# Altium schematic sheet ESP32_schematic.SchDoc
size A4; SheetNumber: 1; SheetTotal: 1
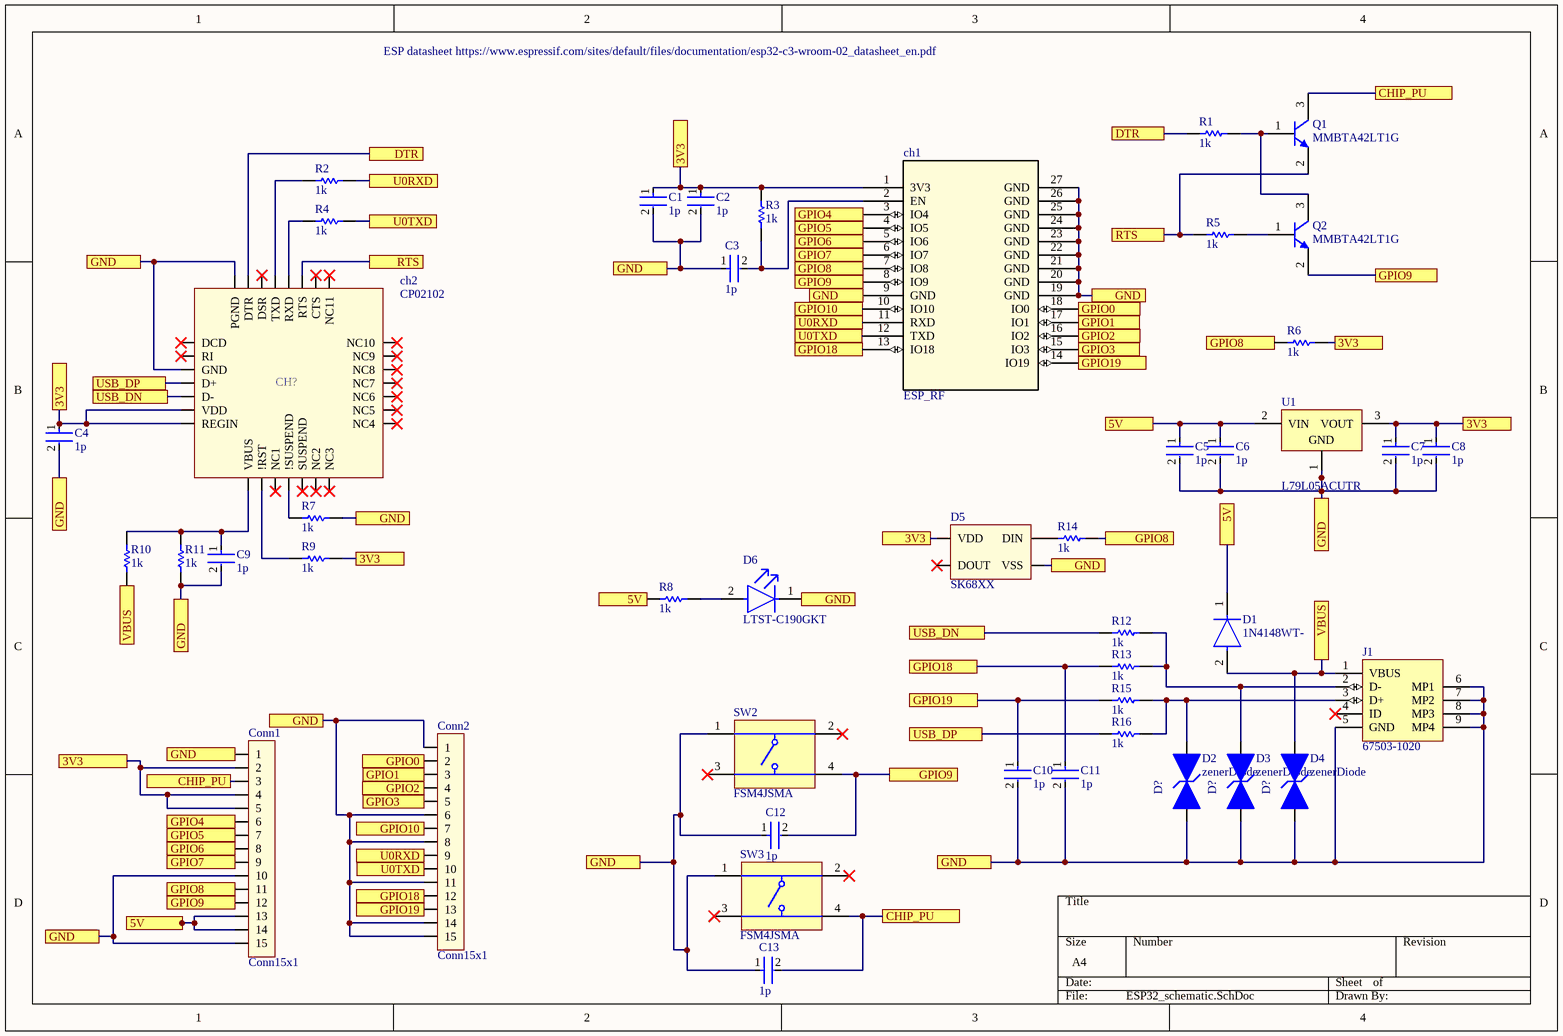
[diagram p0: ESP32_schematic.SchDoc]

## Parts
C1  1p  [FP-C0402-BB-MFG]
C2  1p  [FP-C0402-BB-MFG]
C3  1p  [FP-C0402-BB-MFG]
C4  1p  [FP-C0402-BB-MFG]
C5  1p  [FP-C0402-BB-MFG]
C6  1p  [FP-C0402-BB-MFG]
C7  1p  [FP-C0402-BB-MFG]
C8  1p  [FP-C0402-BB-MFG]
C9  1p  [FP-C0402-BB-MFG]
C10  1p  [FP-C0402-BB-MFG]
C11  1p  [FP-C0402-BB-MFG]
C12  1p  [FP-C0402-BB-MFG]
C13  1p  [FP-C0402-BB-MFG]
ch1  ESP_RF  [ESP_RF - duplicate]
ch2  CP02102  [ESPchip]
Conn1  Conn15x1  [Conn15x1]
Conn2  Conn15x1  [Conn15x1]
D1  1N4148WT-  [FP-SOD523-MFG]
D2  zenerDiode  [LESD5D5]
D3  zenerDiode  [LESD5D5]
D4  zenerDiode  [LESD5D5]
D5  SK68XX  [SD68XX]
D6  LTST-C190GKT  [FP-LTST-C190GKT-MFG]
J1  67503-1020  [MOLX-67503-1020_V]
Q1  MMBTA42LT1G  [ONSC-SOT-23-3-318-08_V]
Q2  MMBTA42LT1G  [ONSC-SOT-23-3-318-08_V]
R1  1k  [RESC1609X50X30NL8T20]
R2  1k  [RESC1609X50X30NL8T20]
R3  1k  [RESC1609X50X30NL8T20]
R4  1k  [RESC1609X50X30NL8T20]
R5  1k  [RESC1609X50X30NL8T20]
R6  1k  [RESC1609X50X30NL8T20]
R7  1k  [RESC1609X50X30NL8T20]
R8  1k  [RESC1609X50X30NL8T20]
R9  1k  [RESC1609X50X30NL8T20]
R10  1k  [RESC1609X50X30NL8T20]
R11  1k  [RESC1609X50X30NL8T20]
R12  1k  [RESC1609X50X30NL8T20]
R13  1k  [RESC1609X50X30NL8T20]
R14  1k  [RESC1609X50X30NL8T20]
R15  1k  [RESC1609X50X30NL8T20]
R16  1k  [RESC1609X50X30NL8T20]
SW2  FSM4JSMA  [TECO-FSM4JSMA_V]
SW3  FSM4JSMA  [TECO-FSM4JSMA_V]
U1  L79L05ACUTR  [SOT-89_L]

## Ports
3V3 (see ESP32_schematic[1B], ESP32_schematic[1C], ESP32_schematic[2A], ESP32_schematic[3C], ESP32_schematic[4B]), 3V3 (see ESP32_schematic[1B], ESP32_schematic[1C], ESP32_schematic[2A], ESP32_schematic[4B]), 3V3 (see ESP32_schematic[1B], ESP32_schematic[1C], ESP32_schematic[3C], ESP32_schematic[4B]), 3V3 (see ESP32_schematic[1C], ESP32_schematic[2A], ESP32_schematic[3C], ESP32_schematic[4B]), 5V (see ESP32_schematic[1D], ESP32_schematic[2C], ESP32_schematic[3B]), 5V (see ESP32_schematic[1D], ESP32_schematic[2C], ESP32_schematic[4C]), 5V (see ESP32_schematic[1D], ESP32_schematic[3B], ESP32_schematic[4C]), 5V (see ESP32_schematic[2C], ESP32_schematic[3B], ESP32_schematic[4C]), CHIP_PU (see ESP32_schematic[1D], ESP32_schematic[3D]), CHIP_PU (see ESP32_schematic[1D], ESP32_schematic[4A]), CHIP_PU (see ESP32_schematic[3D], ESP32_schematic[4A]), DTR (see ESP32_schematic[1A]), DTR (see ESP32_schematic[3A]), GND (see ESP32_schematic[1B], ESP32_schematic[1C], ESP32_schematic[1D], ESP32_schematic[2B], ESP32_schematic[2D], ESP32_schematic[3B], ESP32_schematic[3C], ESP32_schematic[3D]), GND (see ESP32_schematic[1B], ESP32_schematic[1C], ESP32_schematic[1D], ESP32_schematic[2B], ESP32_schematic[2D], ESP32_schematic[3B], ESP32_schematic[3C], ESP32_schematic[3D], ESP32_schematic[4C]), GND (see ESP32_schematic[1B], ESP32_schematic[1C], ESP32_schematic[1D], ESP32_schematic[2B], ESP32_schematic[2D], ESP32_schematic[3B], ESP32_schematic[3C], ESP32_schematic[4C]), GND (see ESP32_schematic[1B], ESP32_schematic[1C], ESP32_schematic[1D], ESP32_schematic[2B], ESP32_schematic[3B], ESP32_schematic[3C], ESP32_schematic[3D], ESP32_schematic[4C]), GND (see ESP32_schematic[1B], ESP32_schematic[1C], ESP32_schematic[1D], ESP32_schematic[2D], ESP32_schematic[3B], ESP32_schematic[3C], ESP32_schematic[3D], ESP32_schematic[4C]), GND (see ESP32_schematic[1B], ESP32_schematic[1C], ESP32_schematic[2B], ESP32_schematic[2D], ESP32_schematic[3B], ESP32_schematic[3C], ESP32_schematic[3D], ESP32_schematic[4C]), GND (see ESP32_schematic[1C], ESP32_schematic[1D], ESP32_schematic[2B], ESP32_schematic[2D], ESP32_schematic[3B], ESP32_schematic[3C], ESP32_schematic[3D], ESP32_schematic[4C]), GPIO0 (see ESP32_schematic[1C]), GPIO0 (see ESP32_schematic[3B]), GPIO1 (see ESP32_schematic[1D]), GPIO1 (see ESP32_schematic[3B]), GPIO2 (see ESP32_schematic[1D]), GPIO2 (see ESP32_schematic[3B]), GPIO3 (see ESP32_schematic[1D]), GPIO3 (see ESP32_schematic[3B]), GPIO4 (see ESP32_schematic[1D]), GPIO4 (see ESP32_schematic[3A]), GPIO5 (see ESP32_schematic[1D]), GPIO5 (see ESP32_schematic[3A]), GPIO6 (see ESP32_schematic[1D]), GPIO6 (see ESP32_schematic[3A]), GPIO7 (see ESP32_schematic[1D]), GPIO7 (see ESP32_schematic[3A]), GPIO8 (see ESP32_schematic[1D], ESP32_schematic[3B], ESP32_schematic[3C]), GPIO8 (see ESP32_schematic[1D], ESP32_schematic[3B], ESP32_schematic[4B]), GPIO8 (see ESP32_schematic[1D], ESP32_schematic[3C], ESP32_schematic[4B]), GPIO8 (see ESP32_schematic[3B], ESP32_schematic[3C], ESP32_schematic[4B]), GPIO9 (see ESP32_schematic[1D], ESP32_schematic[3B], ESP32_schematic[3D]), GPIO9 (see ESP32_schematic[1D], ESP32_schematic[3B], ESP32_schematic[4B]), GPIO9 (see ESP32_schematic[1D], ESP32_schematic[3D], ESP32_schematic[4B]), GPIO9 (see ESP32_schematic[3B], ESP32_schematic[3D], ESP32_schematic[4B]), GPIO10 (see ESP32_schematic[1D]), GPIO10 (see ESP32_schematic[3B]), GPIO18 (see ESP32_schematic[1D], ESP32_schematic[3B]), GPIO18 (see ESP32_schematic[1D], ESP32_schematic[3C]), GPIO18 (see ESP32_schematic[3B], ESP32_schematic[3C]), GPIO19 (see ESP32_schematic[1D], ESP32_schematic[3B]), GPIO19 (see ESP32_schematic[1D], ESP32_schematic[3C]), GPIO19 (see ESP32_schematic[3B], ESP32_schematic[3C]), RTS (see ESP32_schematic[1B]), RTS (see ESP32_schematic[3A]), U0RXD (see ESP32_schematic[1A], ESP32_schematic[1D]), U0RXD (see ESP32_schematic[1A], ESP32_schematic[3B]), U0RXD (see ESP32_schematic[1D], ESP32_schematic[3B]), U0TXD (see ESP32_schematic[1A], ESP32_schematic[1D]), U0TXD (see ESP32_schematic[1A], ESP32_schematic[3B]), U0TXD (see ESP32_schematic[1D], ESP32_schematic[3B]), USB_DN (see ESP32_schematic[1B]), USB_DN (see ESP32_schematic[3C]), USB_DP (see ESP32_schematic[1B]), USB_DP (see ESP32_schematic[3C]), VBUS (see ESP32_schematic[1C]), VBUS (see ESP32_schematic[4C])

## Nets
3V3: C1.1 C2.1 C4.1 C7.1 C8.1 ch1.1(3V3) ch2.6(VDD) ch2.7(REGIN) Conn1.2 Conn1.4 Conn1.5 D5.3(VDD) R3.2 R6.2 R9.2 U1.3(VOUT) ; port 3V3
5V: C5.1 C6.1 Conn1.13 Conn1.14 D1.1(C) R8.1 U1.2(VIN) ; port 5V
CHIP_PU: C13.2 Conn1.3 Q1.3(C) SW3.4 ; port CHIP_PU
DTR: ch2.28(DTR) R1.1 ; port DTR
GND: C1.2 C2.2 C3.1 C4.2 C5.2 C6.2 C7.2 C8.2 C9.2 C10.2 C11.2 C12.1 C13.1 ch1.9(GND) ch1.19(GND) ch1.20(GND) ch1.21(GND) ch1.22(GND) ch1.23(GND) ch1.24(GND) ch1.25(GND) ch1.26(GND) ch1.27(GND) ch2.3(GND) ch2.29(PGND) Conn1.1 Conn1.10 Conn1.15 Conn2.1 Conn2.6 Conn2.8 Conn2.11 Conn2.14 Conn2.15 D2.1 D3.1 D4.1 D5.1(VSS) D6.1(C) J1.5(GND) J1.6(MP1) J1.7(MP2) J1.8(MP3) J1.9(MP4) R7.2 R11.1 SW2.1 SW3.1 U1.1(GND) ; port GND
GPIO0: ch1.18(IO0) Conn2.2 ; port GPIO0
GPIO1: ch1.17(IO1) Conn2.3 ; port GPIO1
GPIO2: ch1.16(IO2) Conn2.4 ; port GPIO2
GPIO3: ch1.15(IO3) Conn2.5 ; port GPIO3
GPIO4: ch1.3(IO4) Conn1.6 ; port GPIO4
GPIO5: ch1.4(IO5) Conn1.7 ; port GPIO5
GPIO6: ch1.5(IO6) Conn1.8 ; port GPIO6
GPIO7: ch1.6(IO7) Conn1.9 ; port GPIO7
GPIO8: ch1.7(IO8) Conn1.11 R6.1 R14.2 ; port GPIO8
GPIO9: C12.2 ch1.8(IO9) Conn1.12 Q2.2(E) SW2.4 ; port GPIO9
GPIO10: ch1.10(IO10) Conn2.7 ; port GPIO10
GPIO18: C11.1 ch1.13(IO18) Conn2.12 R13.1 ; port GPIO18
GPIO19: C10.1 ch1.14(IO19) Conn2.13 R15.1 ; port GPIO19
RTS: ch2.24(RTS) Q1.2(E) R5.1 ; port RTS
U0RXD: ch1.11(RXD) Conn2.9 R2.2 ; port U0RXD
U0TXD: ch1.12(TXD) Conn2.10 R4.2 ; port U0TXD
USB_DN: ch2.5(D-) R12.1 ; port USB_DN
USB_DP: ch2.4(D+) R16.1 ; port USB_DP
VBUS: D1.2(A) D4.2 J1.1(VBUS) R10.1 ; port VBUS
NetC3_2: C3.2 ch1.2(EN) R3.1
NetC9_1: C9.1 ch2.8(VBUS) R10.2 R11.2
Netch2_9: ch2.9(!RST) R9.1
Netch2_11: ch2.11(!SUSPEND) R7.1
Netch2_25: ch2.25(RXD) R4.1
Netch2_26: ch2.26(TXD) R2.1
NetD2_2: D2.2 J1.3(D+) R15.2 R16.2
NetD3_2: D3.2 J1.2(D-) R12.2 R13.2
NetD5_2: D5.2(DIN) R14.1
NetD6_2: D6.2(A) R8.2
NetQ1_1: Q1.1(B) Q2.3(C) R1.2
NetQ2_1: Q2.1(B) R5.2

Not connected (* = marked no-connect by the designer): ch2 1(DCD)* 2(RI)* 10(NC1)* 12(SUSPEND)* 13(NC2)* 14(NC3)* 15(NC4)* 16(NC5)* 17(NC6)* 18(NC7)* 19(NC8)* 20(NC9)* 21(NC10)* 22(NC11)* 23(CTS)* 27(DSR)*; D5 4(DOUT)*; J1 4(ID)*; SW2 2* 3*; SW3 2* 3*

## Notes on the sheet
- ESP datasheet https://www.espressif.com/sites/default/files/documentation/esp32-c3-wroom-02_datasheet_en.pdf
- (in symbol CP02102) CH?
- (in symbol zenerDiode) D?

## Library data of the parts
C1-C13 = CMP-2008-02046-2: CAP CER 0.1UF 10V X5R 0402; Manufacturer: Kemet; Manufacturer Part Number: C0402C104K8PACTU; Material: Ceramic; Capacitance: 0.10 μF; Temperature Coefficient: 15%; Tolerance: 0.1; Value: 0.10 μF; Package: C0402-BB; Temperature: -55°C to +125°C; ComponentLink2Description: Datasheet; Temperature Characteristic: X5R; Device Class L1: Passive Components; Height: 0.55mm; Lead Free: Yes; ComponentLink2URL: https://content.kemet.com/datasheets/KEM_C1002_X7R_SMD.pdf; Device Class L2: Capacitors; Temperature Range Low: -55°C; Temperature Range High: +125°C; RoHS: TRUE; Octopart: https://octopart.com/c0402c104k8pactu-kemet-140039; Automotive: No; Mouser Description: Capacitor 100 nF 10 VDC 0402; Category: Cap; Voltage Rating: 10 V; Digikey Description: CAP CER 0.1UF 10V X5R 0402; Ipc Land Pattern Name: CAPC10050X50; Device Class L3: Ceramic Capacitors
D1 = CMP-2000-05518-3: DIODE GEN PURP 80V 125MA SOD523; Power Rating: 150mW; Peak Non-Repetitive Surge Current: 2A; Forward Voltage: 1.25V; Reverse Recovery Time: 4ns; Peak Reverse Current: 1uA; Max Repetitive Reverse Voltage (Vrrm): 100V; Capacitance: 2pF; Polarity: Standard; Element Configuration: Single; Forward Current: 250mA; Lead Free: Lead Free; Packaging: Tape and Reel; Length: 0.9mm; Min Operating Temperature: -65°C; Current Rating: 125mA; Max Reverse Voltage (DC): 80V; Width: 1.3mm; Package Quantity: 3000; Output Current: 125mA; Power Dissipation: 150mW; Max Operating Temperature: 150°C; Radiation Hardening: No; Average Rectified Current: 125mA; Height: 0.65mm; Voltage Rating (DC): 80V; Max Surge Current: 2A; Weight: 3.5E-05oz; Recovery Time: 4ns; Max Forward Surge Current (Ifsm): 2A; Contact Plating: Tin; Number of Pins: 2; Mount: Surface Mount; REACH SVHC: No SVHC
D6 = CMP-22017-000005-2: LED GREEN CLEAR CHIP SMD; Dominant Wavelength: 569nm; Reverse Voltage: 5V; Lens Color: Colorless; Viewing Angle: 130°; Voltage: 2V; Forward Current: 30mA; Power Dissipation: 100mW; Luminous Intensity: 6mcd; Number of LEDs: 1; Forward Voltage: 2.1V; Wavelength: 565nm; Test Current: 10mA; Min Operating Temperature: -55°C; Lens Style: Clear; Mount: Surface Mount; Width: 0.8mm; Packaging: Tape and Reel; Lens Transparency: Clear; Case Code (Metric): 1608; Depth: 0.8mm; Case Code (Imperial): 0603; Case/Package: 0603; Number of Pins: 2; Max Operating Temperature: 85°C; Lead Free: Lead Free; Number of Elements: 1; Length: 1.6mm; Height: 0.8mm; Package Quantity: 1; Power Rating: 100mW; Radiation Hardening: No; Illumination Color: Green; Color: Green
J1 = CMP-0411-00002-1: USB, MINI, SMD, RA KME04-USBMU03A01; Manufacturer: Molex; ComponentLink1URL: http://www.molex.com/; PartNumber: 67503-1020; Mounting Technology: Surface Mount; ComponentLink1Description: Manufacturer URL; Terminal Pitch: 0.8 mm; DatasheetVersion: Rev F, 06/2009; ComponentLink2Description: Datasheet; PackageDescription: Mini USB Connector, SMT, Righer Angle; ComponentLink2URL: http://www.molex.com/pdm_docs/sd/675031020_sd.pdf; PackageReference: 67503-1020
Q1 Q2 = CMP-1048-00662-1: High Voltage Transistor, NPN Silicon, 3-Pin SOT-23, Pb-Free, Tape and Reel; Manufacturer: On Semiconductor; fT Min (MHz): 50; IC Continuous (A): 0.5; ComponentLink1URL: http://www.onsemi.com/; ComponentLink3URL: http://www.onsemi.cn/pub_link/Collateral/318-08.PDF; RoHS: TRUE; ComponentLink2Description: Datasheet; PartNumber: MMBTA42LT1G; Polarity: NPN; DatasheetVersion: Rev. 12; PackageReference: SOT-23-3-318-08; PackageDescription: 3-Pin Small Outline Transistor, Body 2.92 x 1.3 mm, Pitch 0.95 mm; ComponentLink3Description: Package Specification; ComponentLink1Description: Manufacturer URL; Packing: Tape and Reel; PackageVersion: Rev. AP, 11/2009; Mounting Technology: Surface Mount; ComponentLink2URL: http://www.onsemi.cn/pub_link/Collateral/MMBTA42LT1-D.PDF
R1-R16 = CMP-2000-03816-5: Chip Resistor, 0 Ohm, Jumper, 100 mW, -55 to 155 degC, 0603 (1608 Metric), RoHS, Tape and Reel; Manufacturer: Vishay Semiconductor; Voltage Rating: 75 V; Package Quantity: 5000; DatasheetVersion: 06/2012; Min Operating Temperature: -55 degC; ComponentLink1URL: http://www.vishay.com/; Mounting Technology: Surface Mount; Height: 0.45 mm; ComponentLink1Description: Manufacturer URL; REACH SVHC: Unknown; PackageReference: 0603; Packaging: Tape and Reel; Max Operating Temperature: 155 degC; Mount: Surface Mount; ComponentLink2Description: Datasheet; PackageDescription: 2-Pin Surface Mount Device, Body 1.575 x 0.85 mm; Length: 1.55 mm; ComponentLink2URL: http://www.vishay.com/docs/20035/dcrcwe3.pdf; Pins: 2; RoHSCompliant: true
SW2 SW3 = CMP-2000-05602-2: Swicth, SPST, 24 V, -35 to 85 degC, 4-Pin SMD, RoHS, Tape and Reel; Manufacturer: TE Connectivity; Switch Travel: 0.25mm; Mechanical Life: 100000Cycles; Contact Current Rating: 50mA; Operating Force: 1.57N; Actuator Material: Polyamide; Contact Resistance: 100mOhm; Voltage Rating: 24V; Illumination Type: Illuminated; Actuator Length: 0.055inch; Max Voltage Rating (DC): 12V; Case\/Package: SMD/SMT; Orientation: Straight; Datasheet URL: http://www.te.com/commerce/DocumentDelivery/DDEController?Action=showdoc&DocId=Customer+Drawing%7F2-1437565-7%7FV%7Fpdf%7FEnglish%7FENG_CD_2-1437565-7_V.pdf%7F4-1437565-2; Min Operating Temperature: -35degC; Packaging: LoosePiece; Termination: GullWing; Throw Configuration: SPST; Package Description: 4-Pin Surface Mount Device, Body 6 x 6 mm, Pitch 4.5 mm; Mounting Technology: SurfaceMount; Contact Plating: Silver; Datasheet Version: Rev. V, 02/2015; RoHSCompliant: true; Max Operating Temperature: 85degC; Length: 6mm; Voltage Rating (DC): 24V; Electrical Life: 100000Cycles; Current Rating: 50mA; Package Quantity: 750; Mount: SurfaceMount; Package Reference: FSM4JSMA; Manufacturer URL: http://www.te.com/; Width: 6mm; REACH SVHC: Unknown; Contact Material: CopperAlloy
U1 = CMP-0244-00395-1: Negative Voltage Regulator, -5V, 4-Pin SOT-89, Tape and Reel; ComponentLink1Description: Manufacturer URL; ComponentLink2Description: Datasheet; PackageVersion: 2011; ComponentLink2URL: http://www.st.com/internet/com/TECHNICAL_RESOURCES/TECHNICAL_LITERATURE/DATASHEET/CD00000539.pdf; PackageReference: SOT-89; DatasheetVersion: 1/07/2009; PackageDescription: 3-Pin SOT-89 Package 1.5 mm Pitch, 4.1 mm Lead Span; ComponentLink1URL: http://www.st.com